# Altium schematic sheet MAXII.SCHDOC
size A4; Organization: UNSW Solar Racing Team; Address3: UNSW; Address4: Sydney NSW 2052; Address2: Electrical Engineering; Address1: Rm 109
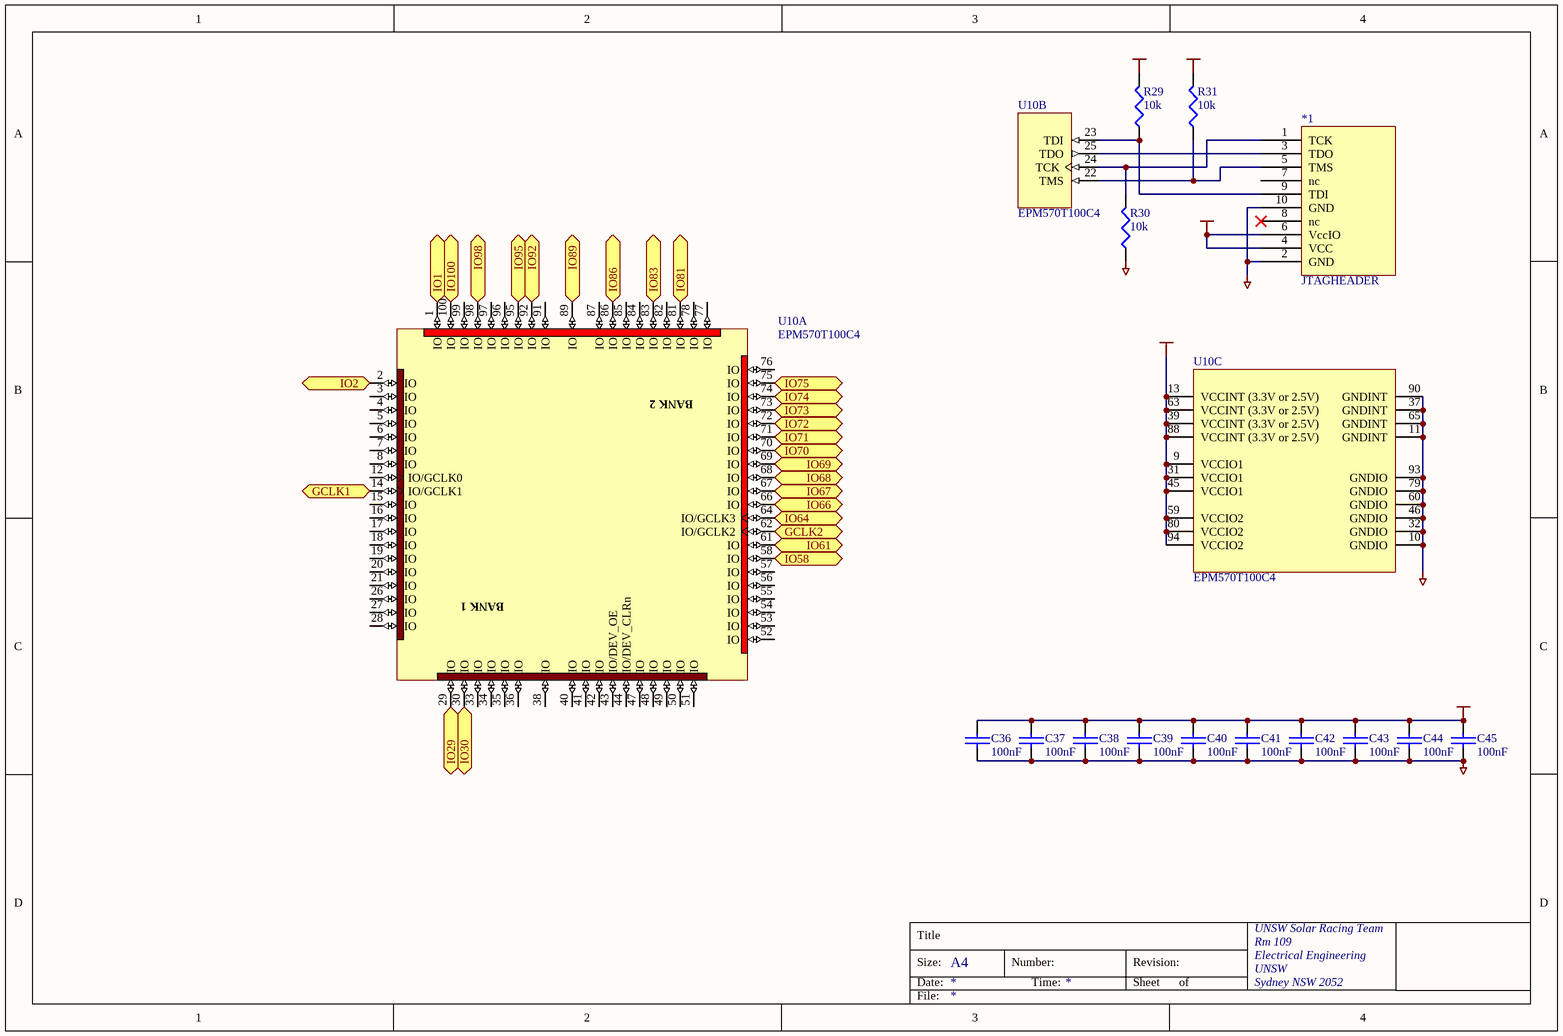
[diagram p0: MAXII.SCHDOC]

## Parts
*1  JTAGHEADER  [HDR2X5]
C36  100nF  [0603]
C37  100nF  [0603]
C38  100nF  [0603]
C39  100nF  [0603]
C40  100nF  [0603]
C41  100nF  [0603]
C42  100nF  [0603]
C43  100nF  [0603]
C44  100nF  [0603]
C45  100nF  [0603]
R29  10k  [0603]
R30  10k  [0603]
R31  10k  [0603]
U10  EPM570T100C4  [TQFP100]  (parts A,B,C of 3)

## Ports
GCLK1 (in), GCLK2 (in), IO1, IO2, IO29, IO30, IO58 (in), IO61, IO64 (in), IO66, IO67, IO68, IO69, IO70, IO71, IO72, IO73, IO74, IO75, IO81, IO83, IO86, IO89, IO92, IO95, IO98, IO100

## Nets
3V3: *1.4(VCC) *1.6(VccIO) C36.1 C37.1 C38.1 C39.1 C40.1 C41.1 C42.1 C43.1 C44.1 C45.1 R29.2 R31.2 U10.9(VCCIO1) U10.13(VCCINT_(3.3V_or_2.5V)) U10.31(VCCIO1) U10.39(VCCINT_(3.3V_or_2.5V)) U10.45(VCCIO1) U10.59(VCCIO2) U10.63(VCCINT_(3.3V_or_2.5V)) U10.80(VCCIO2) U10.88(VCCINT_(3.3V_or_2.5V)) U10.94(VCCIO2)
GND: *1.2(GND) *1.10(GND) C36.2 C37.2 C38.2 C39.2 C40.2 C41.2 C42.2 C43.2 C44.2 C45.2 R30.1 U10.10(GNDIO) U10.11(GNDINT) U10.32(GNDIO) U10.37(GNDINT) U10.46(GNDIO) U10.60(GNDIO) U10.65(GNDINT) U10.79(GNDIO) U10.90(GNDINT) U10.93(GNDIO)
GCLK1: U10.14(IO/GCLK1) ; port GCLK1
GCLK2: U10.62(IO/GCLK2) ; port GCLK2
IO1: U10.1(IO) ; port IO1
IO2: U10.2(IO) ; port IO2
IO29: U10.29(IO) ; port IO29
IO30: U10.30(IO) ; port IO30
IO58: U10.58(IO) ; port IO58
IO61: U10.61(IO) ; port IO61
IO64: U10.64(IO/GCLK3) ; port IO64
IO66: U10.66(IO) ; port IO66
IO67: U10.67(IO) ; port IO67
IO68: U10.68(IO) ; port IO68
IO69: U10.69(IO) ; port IO69
IO70: U10.70(IO) ; port IO70
IO71: U10.71(IO) ; port IO71
IO72: U10.72(IO) ; port IO72
IO73: U10.73(IO) ; port IO73
IO74: U10.74(IO) ; port IO74
IO75: U10.75(IO) ; port IO75
IO81: U10.81(IO) ; port IO81
IO83: U10.83(IO) ; port IO83
IO86: U10.86(IO) ; port IO86
IO89: U10.89(IO) ; port IO89
IO92: U10.92(IO) ; port IO92
IO95: U10.95(IO) ; port IO95
IO98: U10.98(IO) ; port IO98
IO100: U10.100(IO) ; port IO100
Net*1_1: *1.1(TCK) R30.2 U10.24(TCK)
Net*1_3: *1.3(TDO) U10.25(TDO)
Net*1_5: *1.5(TMS) R31.1 U10.22(TMS)
Net*1_9: *1.9(TDI) R29.1 U10.23(TDI)

Not connected (* = marked no-connect by the designer): *1 7(nc) 8(nc)*; U10 3(IO) 4(IO) 5(IO) 6(IO) 7(IO) 8(IO) 12(IO/GCLK0) 15(IO) 16(IO) 17(IO) 18(IO) 19(IO) 20(IO) 21(IO) 26(IO) 27(IO) 28(IO) 33(IO) 34(IO) 35(IO) 36(IO) 38(IO) 40(IO) 41(IO) 42(IO) 43(IO/DEV_OE) 44(IO/DEV_CLRn) 47(IO) 48(IO) 49(IO) 50(IO) 51(IO) 52(IO) 53(IO) 54(IO) 55(IO) 56(IO) 57(IO) 76(IO) 77(IO) 78(IO) 82(IO) 84(IO) 85(IO) 87(IO) 91(IO) 96(IO) 97(IO) 99(IO)

## Notes on the sheet
- Title
- Size:
- Date:
- A4
- Number:
- Time:
- Revision:
- Sheet
- of
- File:
- (in symbol EPM570T100C4, part A) BANK 2; BANK 1

## Library data of the parts
C36-C45 = CAP: Capacitor; Farnell: 753-567; Price: 0.30
R29-R31 = RES1: Resistor; Farnell: 612-601; Price: 0.11
U10 = EPM570T100C4: MAX II 2.5/3.3V FPGA, 76 I/Os, 100-Pin Plastic TQFP, Commercial Temperature, Speed Grade 4; Note: Each set of VCCIO pins can be connected to 3.3V, 2.5V, 1.8V, or 1.5V.; Published: 15-Jul-2004; DatasheetDocument: ver1.1, Jun-2004; PackageDocument: Mar-2004; PackageReference: TQFP100; Publisher: Altium Limited; Code_JEDEC: MS-026-BDE; Code_IPC: SQFP14X14-100; Farnell: NA
*1 = JTAGHEADER: Farnell: 302-1439; Price: 2.19